# EAGLE design WiFi 5 Ray Detector v1 (EAGLE 7.7.0)
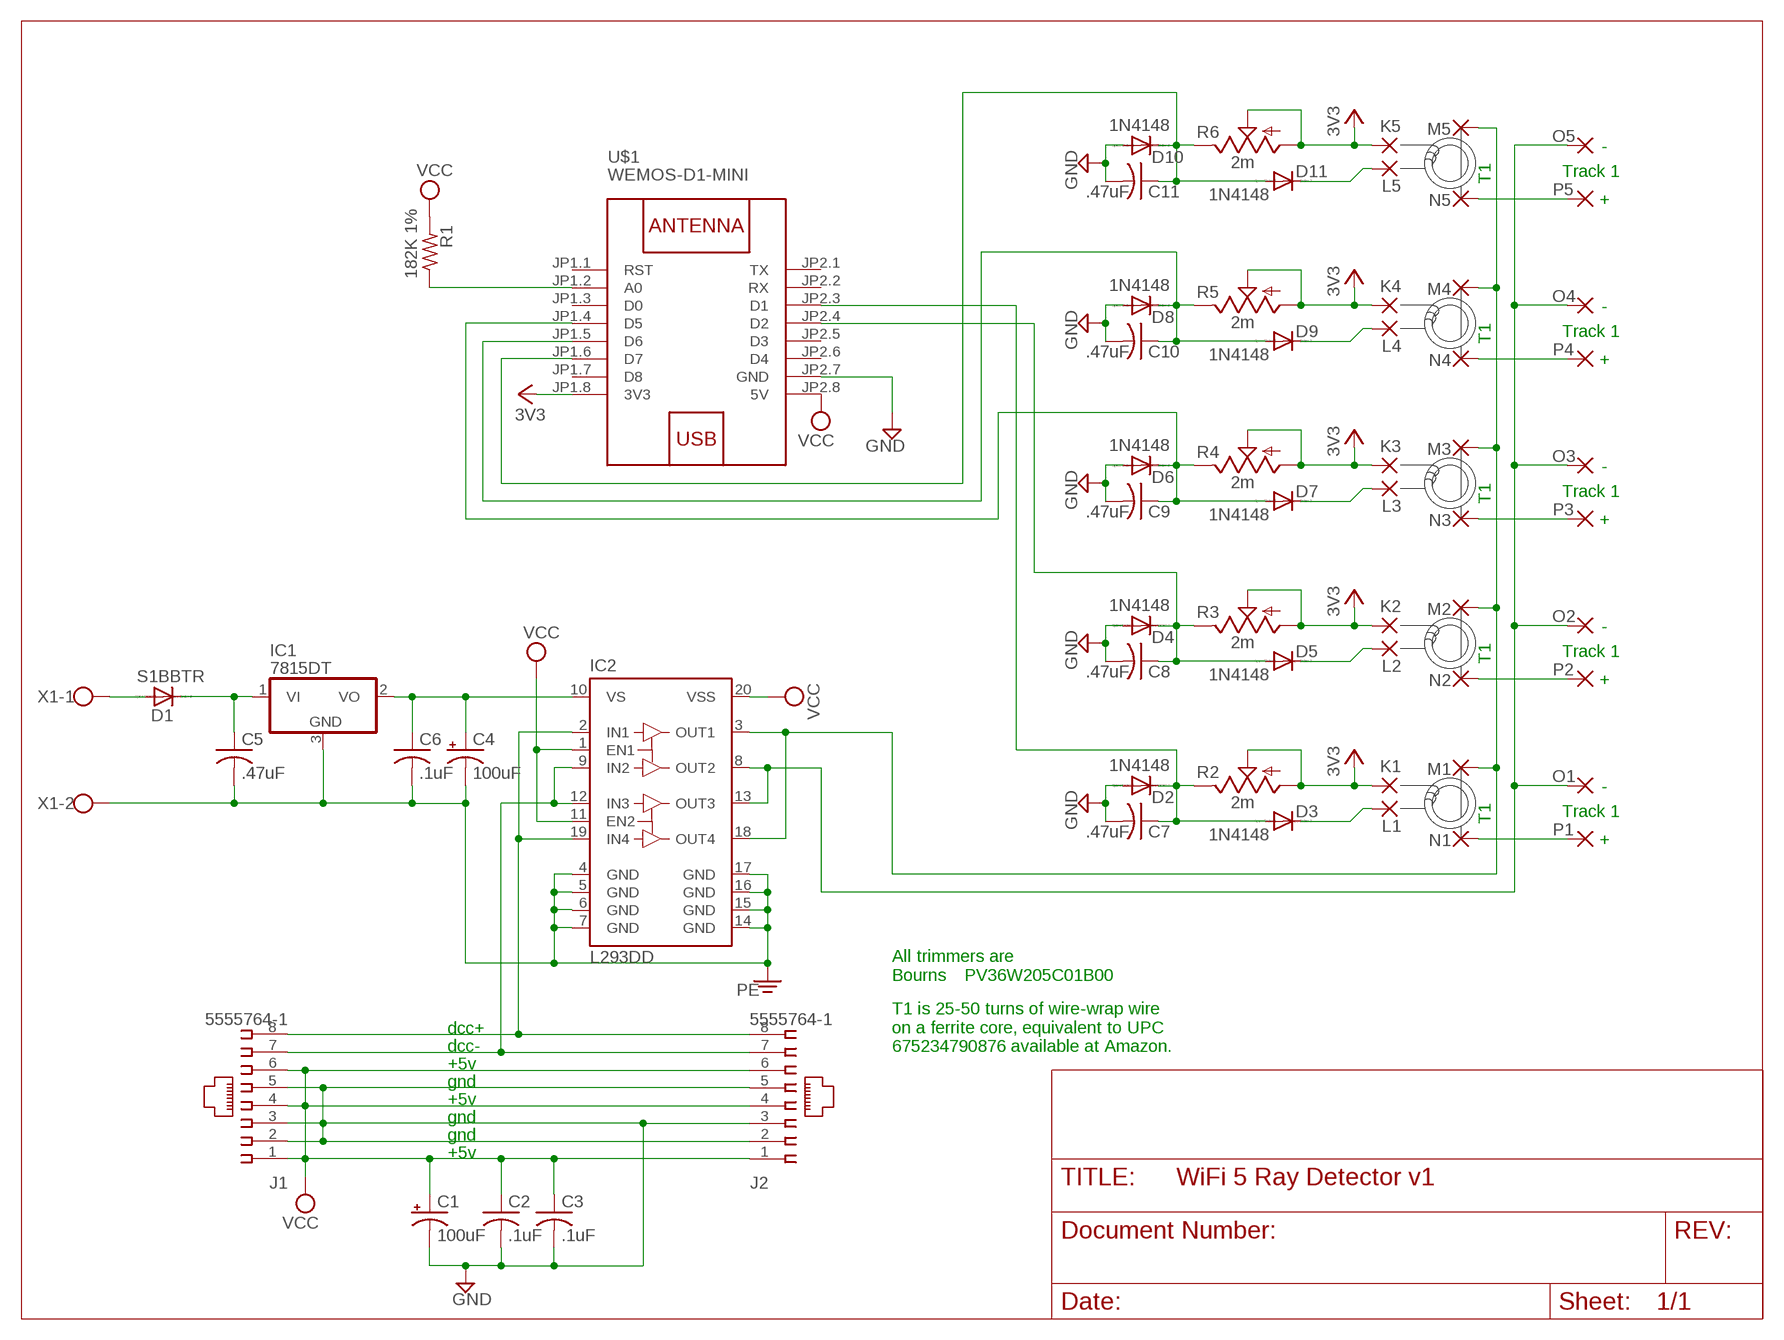
[diagram p0: schematic, sheet 1]

## Parts
C1  100uF  CPOL-USE3.5-8  [E3,5-8]
C2  .1uF  C-USC1206  [C1206]
C3  .1uF  C-USC1206  [C1206]
C4  100uF  CPOL-USE3.5-8  [E3,5-8]
C5  .47uF  C-USC1206  [C1206]
C6  .1uF  C-USC1206  [C1206]
C7  .47uF  C-USC1206  [C1206]
C8  .47uF  C-USC1206  [C1206]
C9  .47uF  C-USC1206  [C1206]
C10  .47uF  C-USC1206  [C1206]
C11  .47uF  C-USC1206  [C1206]
D1  S1BBTR  DIODE-DO-214AC  [DO-214AC]
D2  1N4148  DIODE-SOD123  [SOD123]
D3  1N4148  DIODE-SOD123  [SOD123]
D4  1N4148  DIODE-SOD123  [SOD123]
D5  1N4148  DIODE-SOD123  [SOD123]
D6  1N4148  DIODE-SOD123  [SOD123]
D7  1N4148  DIODE-SOD123  [SOD123]
D8  1N4148  DIODE-SOD123  [SOD123]
D9  1N4148  DIODE-SOD123  [SOD123]
D10  1N4148  DIODE-SOD123  [SOD123]
D11  1N4148  DIODE-SOD123  [SOD123]
IC1  7815DT  7818DT  [TO252]
IC2  L293DD  [SO20]
J1  5555764-1  520426-4  [520426-4]
J2  5555764-1  520426-4  [520426-4]
K1  2,15/1,0  [2,15/1,0]
K2  2,15/1,0  [2,15/1,0]
K3  2,15/1,0  [2,15/1,0]
K4  2,15/1,0  [2,15/1,0]
K5  2,15/1,0  [2,15/1,0]
L1  2,15/1,0  [2,15/1,0]
L2  2,15/1,0  [2,15/1,0]
L3  2,15/1,0  [2,15/1,0]
L4  2,15/1,0  [2,15/1,0]
L5  2,15/1,0  [2,15/1,0]
M1  NA  2,15/1,0  [2,15/1,0]
M2  NA  2,15/1,0  [2,15/1,0]
M3  NA  2,15/1,0  [2,15/1,0]
M4  NA  2,15/1,0  [2,15/1,0]
M5  NA  2,15/1,0  [2,15/1,0]
N1  NA  2,15/1,0  [2,15/1,0]
N2  NA  2,15/1,0  [2,15/1,0]
N3  NA  2,15/1,0  [2,15/1,0]
N4  NA  2,15/1,0  [2,15/1,0]
N5  NA  2,15/1,0  [2,15/1,0]
O1  NA  2,15/1,0  [2,15/1,0]
O2  NA  2,15/1,0  [2,15/1,0]
O3  NA  2,15/1,0  [2,15/1,0]
O4  NA  2,15/1,0  [2,15/1,0]
O5  NA  2,15/1,0  [2,15/1,0]
P1  NA  2,15/1,0  [2,15/1,0]
P2  NA  2,15/1,0  [2,15/1,0]
P3  NA  2,15/1,0  [2,15/1,0]
P4  NA  2,15/1,0  [2,15/1,0]
P5  NA  2,15/1,0  [2,15/1,0]
R1  182K 1%  R-US_M1206  [M1206]
R2  2m  TRIM_US-S63P  [S63P]
R3  2m  TRIM_US-S63P  [S63P]
R4  2m  TRIM_US-S63P  [S63P]
R5  2m  TRIM_US-S63P  [S63P]
R6  2m  TRIM_US-S63P  [S63P]
U$1  WEMOS-D1-MINI  [WEMOS-D1-MINI]
X1  W237-102  [W237-102]

## Nets
3V3: K1.1(P) K2.1(P) K3.1(P) K4.1(P) K5.1(P) R2.A R2.S R3.A R3.S R4.A R4.S R5.A R5.S R6.A R6.S U$1.JP1.8(3V3)
GND: C1.- C2.2 C3.2 C7.2 C8.2 C9.2 C10.2 C11.2 D2.A D4.A D6.A D8.A D10.A J1.2 J1.3 J1.5 J2.2 J2.3 J2.5 U$1.JP2.7(GND)
J1: N1.1(P) P1.1(P)
J2: N2.1(P) P2.1(P)
J3: N3.1(P) P3.1(P)
J4: N4.1(P) P4.1(P)
J5: N5.1(P) P5.1(P)
N$1: D5.C L2.1(P)
N$2: C9.1 D6.C D7.A R4.E U$1.JP1.4(D5)
N$3: C7.1 D2.C D3.A R2.E U$1.JP2.3(D1)
N$4: D1.A X1.1
N$5: C5.1 D1.C IC1.1(VI)
N$6: C8.1 D4.C D5.A R3.E U$1.JP2.4(D2)
N$7: IC2.9(IN2) IC2.12(IN3) J1.7 J2.7
N$8: D7.C L3.1(P)
N$9: C10.1 D8.C D9.A R5.E U$1.JP1.5(D6)
N$10: D9.C L4.1(P)
N$11: C11.1 D10.C D11.A R6.E U$1.JP1.6(D7)
N$12: R1.1 U$1.JP1.2(A0)
N$13: D11.C L5.1(P)
N$18: IC2.2(IN1) IC2.19(IN4) J1.8 J2.8
N$45: D3.C L1.1(P)
OUT+: IC2.3(OUT1) IC2.18(OUT4) M1.1(P) M2.1(P) M3.1(P) M4.1(P) M5.1(P)
OUT-: IC2.8(OUT2) IC2.13(OUT3) O1.1(P) O2.1(P) O3.1(P) O4.1(P) O5.1(P)
PE: C4.- C5.2 C6.2 IC1.3(GND) IC2.4(GND) IC2.5(GND) IC2.6(GND) IC2.7(GND) IC2.14(GND) IC2.15(GND) IC2.16(GND) IC2.17(GND) X1.2
VCC: C1.+ C2.1 C3.1 IC2.1(EN1) IC2.11(EN2) IC2.20(VSS) J1.1 J1.4 J1.6 J2.1 J2.4 J2.6 R1.2 U$1.JP2.8(5V)
VS: C4.+ C6.1 IC1.2(VO) IC2.10(VS)
Unconnected: U$1.JP1.1(RST) U$1.JP1.3(D0) U$1.JP1.7(D8) U$1.JP2.1(TX) U$1.JP2.2(RX) U$1.JP2.5(D3) U$1.JP2.6(D4)

## Notes on the sheet
- -
- T1
- Track 1
- +
- -
- T1
- Track 1
- +
- -
- T1
- Track 1
- +
- -
- T1
- Track 1
- +
- -
- T1
- Track 1
- +
- All trimmers are
  Bourns‎ PV36W205C01B00
- dcc+
- dcc-
- T1 is 25-50 turns of wire-wrap wire
  on a ferrite core, equivalent to UPC 
  675234790876 available at Amazon.
- +5v
- gnd
- +5v
- gnd
- gnd
- +5v

## Library data of the parts
C1 C4 = rcl:CPOL-US: POLARIZED CAPACITOR, American symbol
C2 C3 C5-C11 = rcl:C-US: CAPACITOR, American symbol
D1-D11 = diode:DIODE-: DIODE
IC1 = linear:78*: Positive VOLTAGE REGULATOR Source: http://cache.national.com/ds/LM/LM78L05.pdf http://www.fairchildsemi.com/ds/LM/LM7805.pdf
IC2 = st-microelectronics:L293DD: PUSH-PULL FOUR CHANNEL DRIVER WITH DIODES Source: http://www.st.com/stonline/books/pdf/docs/1330.pdf; OC_FARNELL: unknown
J1 J2 = con-amp:520426-4: AMP connector
K1-K5 L1-L5 M1-M5 N1-N5 O1-O5 P1-P5 = wirepad:2,15/1,0: THROUGH-HOLE PAD
R1 = rcl:R-US_: RESISTOR, American symbol
R2-R6 = pot:TRIM_US-: POTENTIOMETER
U$1 = diy-modules:WEMOS-D1-MINI: WEMOS D1 mini: Mini Wi-Fi Board based on ESP-8266 device More details can be found here: https://www.wemos.cc/product/d1-mini.html Click here to find device on ebay.com <http://www.ebay.com/sch/wemos+d1+mini+nodemcu>
X1 = con-wago-500:W237-102: WAGO SCREW CLAMP; MPN: 237-102; OC_FARNELL: unknown; OC_NEWARK: 70K9898

## Board
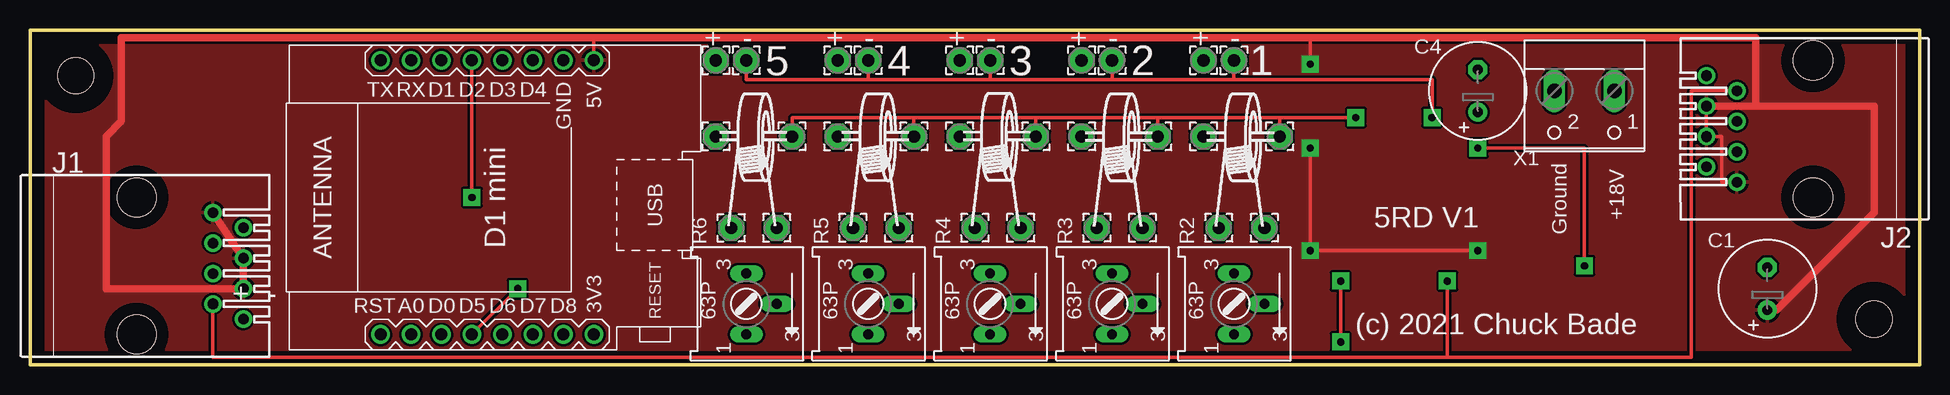
[diagram p1: board, top side]
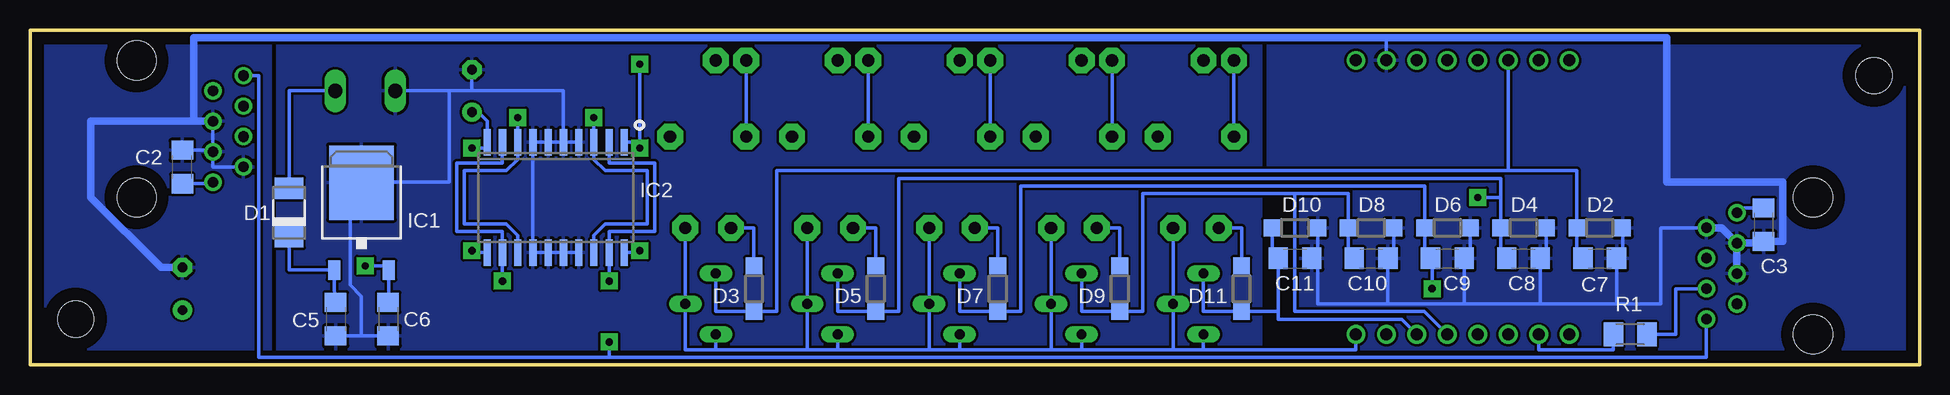
[diagram p2: board, bottom side, seen from below]

Size 157.48 x 27.94 mm. Coordinates in mm from the lower left corner, seen from the top.
Outline: 0,0 157.48,0 157.48,27.94 0,27.94 0,0
Copper layers (1*16): Top 0.035mm / dielectric 1.5mm / Bottom 0.035mm
Design rules "default *": minimum track width 10mil, minimum drill 10mil, track to track 8mil, track to pad 8mil, pad to pad 8mil, via to via 8mil, smd to smd 8mil, copper to edge 40mil, drill to drill 8mil, minimum pad ring 11mil, minimum via ring 16mil, stop-mask expansion 4mil, vias tented up to drill 0mil, thermal gap 10mil

### Footprints (pad centres in the part's own frame; a part is rotated, then mirrored left to right if it is on the bottom)
E3,5-8 = drill 0.813 pad 1.6: + -1.778,0 | drill 0.813 pad 1.6 octagon: - 1.778,0
C1206 = smd 1.6 x 1.8: 1 -1.4,0; 2 1.4,0
DO-214AC = smd 1.8 x 2.4: A 2.025,0; C -2.025,0
SOD123 = smd 1.4 x 1.4: A 1.9,0; C -1.9,0
TO252 = smd 1 x 1.6: 1 -2.28,-4.8; 2 2.28,-4.8 | smd 5.4 x 6.2: 3 0,2.5
SO20 = smd 0.6 x 2.2: 1 -5.715,-4.6; 2 -4.445,-4.6; 3 -3.175,-4.6; 4 -1.905,-4.6; 5 -0.635,-4.6; 6 0.635,-4.6; 7 1.905,-4.6; 8 3.175,-4.6; 9 4.445,-4.6; 10 5.715,-4.6; 11 5.715,4.6; 12 4.445,4.6; 13 3.175,4.6; 14 1.905,4.6; 15 0.635,4.6; 16 -0.635,4.6; 17 -1.905,4.6; 18 -3.175,4.6; 19 -4.445,4.6; 20 -5.715,4.6
520426-4 = drill 0.889: 1 -4.445,6.35; 2 -3.175,8.89; 3 -1.905,6.35; 4 -0.635,8.89; 5 0.635,6.35; 6 1.905,8.89; 7 3.175,6.35; 8 4.445,8.89 | hole 3.251: -5.715,0; 5.715,0
2,15/1,0 = drill 1.016 pad 2.159 octagon: 1 0,0
M1206 = smd 1.6 x 2: 1 -1.4,0; 2 1.4,0
S63P = drill 0.813 long: A 2.54,0; E -2.54,0; S 0,2.54
WEMOS-D1-MINI = drill 1: JP1.1 -11.43,9.525; JP1.2 -11.43,6.985; JP1.3 -11.43,4.445; JP1.4 -11.43,1.905; JP1.5 -11.43,-0.635; JP1.6 -11.43,-3.175; JP1.7 -11.43,-5.715; JP1.8 -11.43,-8.255; JP2.1 11.43,9.525; JP2.2 11.43,6.985; JP2.3 11.43,4.445; JP2.4 11.43,1.905; JP2.5 11.43,-0.635; JP2.6 11.43,-3.175; JP2.7 11.43,-5.715; JP2.8 11.43,-8.255
4-40SCREW = hole 2.997: 0,0
W237-102 = drill 1.194 long: 1 -2.5,-1.27; 2 2.5,-1.27

### Placement (x,y rotation side)
C1  144.78,6.35 90 top
C2  144.78,16.51 90 bottom
C3  13.02,11.68 270 bottom
C4  120.65,22.86 90 top
C5  132.02,3.81 270 bottom
C6  127.63,3.81 270 bottom
C7  26.67,8.89 0 bottom
C8  33.02,8.89 0 bottom
C9  39.37,8.89 0 bottom
C10  45.72,8.89 0 bottom
C11  52.07,8.89 0 bottom
D1  135.89,12.7 90 bottom
D2  26.67,11.43 0 bottom
D3  97.16,6.35 270 bottom
D4  33.02,11.43 0 bottom
D5  86.99,6.35 270 bottom
D6  39.37,11.43 0 bottom
D7  76.83,6.35 270 bottom
D8  45.72,11.43 0 bottom
D9  66.67,6.35 270 bottom
D10  52.07,11.43 0 bottom
D11  56.52,6.35 270 bottom
IC1  129.86,12.7 0 bottom
IC2  113.66,13.97 180 bottom
J1  8.89,8.26 270 top
J2  148.59,19.68 90 top
K1  102.87,11.43 0 top
K2  92.71,11.43 0 top
K3  82.55,11.43 0 top
K4  72.39,11.43 0 top
K5  62.23,11.43 0 top
L1  99.06,11.43 0 top
L2  88.9,11.43 0 top
L3  78.74,11.43 0 top
L4  68.58,11.43 0 top
L5  58.43,11.42 0 top
M1  104.14,19.05 0 top
M2  93.98,19.05 0 top
M3  83.82,19.05 0 top
M4  73.66,19.05 0 top
M5  63.5,19.05 0 top
N1  97.79,19.05 0 top
N2  87.63,19.05 0 top
N3  77.47,19.05 0 top
N4  67.31,19.05 0 top
N5  57.15,19.05 0 top
O1  100.33,25.4 0 top
O2  90.17,25.4 0 top
O3  80.01,25.4 0 top
O4  69.85,25.4 0 top
O5  59.69,25.4 0 top
P1  97.79,25.4 0 top
P2  87.63,25.4 0 top
P3  77.47,25.4 0 top
P4  67.31,25.4 0 top
P5  57.15,25.4 0 top
R1  24.13,2.54 0 bottom
R2  100.33,5.08 270 top
R3  90.17,5.08 270 top
R4  80.01,5.08 270 top
R5  69.85,5.08 270 top
R6  59.69,5.08 270 top
U$1  38.73,13.97 90 top
U$3  [4-40SCREW]  3.81,24.13 0 top
U$4  [4-40SCREW]  153.67,3.81 0 top
X1  129.54,21.59 180 top

### Tracks (layer width: path | path; a pad name or v marks a point on that pad's centre or on a via)
3V3
  Bottom 0.305: U$1.JP1.8 46.99,1.27 59.69,1.27 | R6.A 59.69,1.27 | R5.A 69.85,1.27 | 69.85,1.27 62.23,1.27 | 62.23,1.27 59.69,1.27 | R4.A 80.01,1.27 | 80.01,1.27 72.39,1.27 | 72.39,1.27 69.85,1.27 | 62.23,1.27 R6.S K5.1 | 72.39,1.27 R5.S K4.1 | K3.1 R4.S 82.55,1.27 | 82.55,1.27 80.01,1.27 | R3.A 90.17,1.27 | 90.17,1.27 82.55,1.27 | 92.71,1.27 R3.S K2.1 | 92.71,1.27 90.17,1.27 | R2.A 100.33,1.27 | 100.33,1.27 92.71,1.27 | 100.33,1.27 102.87,1.27 R2.S K1.1
GND
  Bottom 0.305: C2.2 142.37,17.91 J2.3 | J2.2 142.24,16.51 J2.3 | U$1.JP2.7 44.45,27.31 | J2.5 J2.3 | D2.A 24.77,8.89 C7.2 25.27,5.08 | D4.A 31.12,8.89 C8.2 31.62,5.08 | D6.A 37.47,8.89 C9.2 37.97,5.08 | D8.A 43.82,8.89 C10.2 44.32,5.08 | D10.A 50.17,8.89 | 50.17,8.89 C11.2 | 50.17,8.89 50.17,5.08 44.32,5.08 | 44.32,5.08 37.97,5.08 | 37.97,5.08 31.62,5.08 | 31.62,5.08 25.27,5.08 | 25.27,5.08 21.59,5.08 21.59,11.43 J1.2
  Bottom 0.61: J2.5 143.83,20.32 | 143.83,20.32 143.83,27.31 44.45,27.31 21.08,27.31 21.08,15.24 11.43,15.24 11.43,10.28 C3.2 13.02,10.16 J1.3 | 143.83,20.32 152.4,20.32 152.4,13.97 146.56,8.13 C1.- | J1.5 J1.3 | J1.3 16.51,11.43 J1.2
  pour Bottom: -0.95,28.57 54.29,28.57 54.29,-0.95 -0.95,-0.95
  pour Bottom: 158.43,28.57 137.48,28.57 137.48,-0.95 158.43,-0.95
J1
  Bottom 0.305: P1.1 N1.1
J2
  Bottom 0.305: P2.1 N2.1
J3
  Bottom 0.305: P3.1 N3.1
J4
  Bottom 0.305: P4.1 N4.1
J5
  Bottom 0.305: P5.1 N5.1
N$1
  Bottom 0.305: L2.1 86.99,11.43 D5.C
N$2  (via drill 0.6)
  Top 0.305: v40.64,6.35 U$1.JP1.4
  Bottom 0.305: v40.64,6.35 40.64,8.89 C9.1 41.27,8.89 D6.C 41.27,14.92 74.93,14.92 74.93,4.45 D7.A 80.01,4.45 R4.E
N$3
  Bottom 0.305: 34.29,16.19 28.57,16.19 D2.C 28.57,8.89 C7.1 | 34.29,16.19 95.25,16.19 95.25,4.45 D3.A 100.33,4.45 R2.E | U$1.JP2.3 34.29,16.19
N$4
  Bottom 0.305: D1.A 135.89,22.86 X1.1
N$5
  Bottom 0.305: 132.21,7.9 IC1.1 | IC1.1 132.14,6.28 C5.1 132.02,5.08 | D1.C 135.89,7.9 IC1.1
N$6  (via drill 0.6)
  Top 0.305: U$1.JP2.4 v36.83,13.97
  Bottom 0.305: 34.92,13.97 D4.C 34.92,8.89 C8.1 | 34.92,13.97 34.92,15.56 85.09,15.56 85.09,4.45 D5.A 90.17,4.45 R3.E | v36.83,13.97 34.92,13.97
N$7  (via drill 0.6)
  Top 0.305: J1.7 15.24,0.64 118.11,0.64 | 118.11,0.64 138.43,0.64 138.43,22.86 J2.7 | v118.11,6.99 118.11,0.64
  Bottom 0.305: IC2.9 118.11,16.83 121.92,16.83 121.92,11.11 118.11,11.11 IC2.12 v118.11,6.99
N$8
  Bottom 0.305: L3.1 76.83,11.43 D7.C
N$9
  Bottom 0.305: U$1.JP1.5 41.27,4.45 52.07,4.45 52.07,14.29 | 52.07,14.29 47.62,14.29 D8.C 47.62,8.89 C10.1 | 52.07,14.29 64.77,14.29 64.77,4.45 D9.A 69.85,4.45 R5.E
N$10
  Bottom 0.305: L4.1 66.68,11.43 D9.C
N$11
  Bottom 0.305: D10.C 53.97,8.89 C11.1 53.47,4.45 | 53.47,4.45 53.47,3.81 43.18,3.81 U$1.JP1.6 | 53.47,4.45 D11.A 59.69,4.45 R6.E
N$12
  Bottom 0.305: R1.1 25.53,1.27 31.75,1.27 U$1.JP1.2
N$13
  Bottom 0.305: L5.1 56.52,11.43 D11.C
N$18  (via drill 0.6)
  Top 0.305: v109.22,6.99 v109.22,1.91
  Bottom 0.305: IC2.2 109.22,16.83 105.41,16.83 105.41,11.11 109.22,11.11 IC2.19 v109.22,6.99 | J1.8 17.78,0.64 109.22,0.64 | 109.22,0.64 138.43,0.64 138.43,24.13 J2.8 | v109.22,1.91 109.22,0.64
N$45
  Bottom 0.305: L1.1 97.15,11.43 D3.C
OUT+  (via drill 0.6)
  Top 0.305: M5.1 63.5,20.64 73.66,20.64 | 73.66,20.64 83.82,20.64 | 83.82,20.64 93.98,20.64 | 93.98,20.64 104.14,20.64 | M4.1 73.66,20.64 | M3.1 83.82,20.64 | M2.1 93.98,20.64 | M1.1 104.14,20.64 | v110.49,20.64 104.14,20.64
  Bottom 0.305: IC2.18 110.49,10.8 109.54,11.75 106.04,11.75 106.04,16.19 109.54,16.19 110.49,17.15 IC2.3 v110.49,20.64
OUT-  (via drill 0.6)
  Top 0.305: v116.84,20.64 116.84,23.81 100.33,23.81 | 100.33,23.81 90.17,23.81 | 90.17,23.81 80.01,23.81 | 80.01,23.81 69.85,23.81 | 69.85,23.81 59.69,23.81 O5.1 | O4.1 69.85,23.81 | O3.1 80.01,23.81 | O2.1 90.17,23.81 | O1.1 100.33,23.81
  Bottom 0.305: IC2.13 116.84,10.8 117.79,11.75 121.28,11.75 121.28,16.19 117.79,16.19 116.84,17.15 IC2.8 v116.84,20.64
PE
  Bottom 0.305: IC2.5 IC2.6 IC2.7 IC2.14 IC2.15 IC2.16 IC2.17 | IC2.4 IC2.5 | C6.2 129.86,2.41 | 129.86,2.41 C5.2 | 130.81,15.2 130.81,15.24 132.08,15.24 | 122.55,22.86 122.55,15.24 129.86,15.24 IC1.3 130.81,15.2 | 130.81,15.2 130.81,6.67 129.86,5.72 129.86,2.41 | 122.55,22.86 X1.2 | IC2.5 113.03,22.86 120.65,22.86 | 120.65,22.86 C4.- | 120.65,22.86 122.55,22.86
  pour Bottom: 54.93,28.57 136.84,28.57 136.84,-0.95 54.93,-0.95
VCC  (via drill 0.6)
  Top 0.305: J2.6 J2.4 140.97,19.05 140.97,15.24 J2.1 | U$1.JP2.8 46.99,27.31 | v106.68,18.1 v106.68,9.53 v120.65,9.53 | v106.68,25.08 106.68,27.31
  Top 0.61: J2.6 143.83,21.59 | 143.83,21.59 143.83,27.31 106.68,27.31 46.99,27.31 7.62,27.31 7.62,20.32 6.35,19.05 6.35,6.35 J1.6 J1.4 J1.1 | C1.+ 145.54,4.57 153.67,12.7 153.67,21.59 143.83,21.59
  Bottom 0.305: 119.38,9.84 IC2.11 120.49,9.37 v120.65,9.53 | 107.95,18.73 IC2.1 106.68,18.57 v106.68,18.1 v106.68,25.08 | C2.1 142.37,15.11 J2.1 | IC2.20 106.83,9.37 v106.68,9.53 | J1.1 14.86,13.08 C3.1 | R1.2 20.32,2.54 20.32,6.35 J1.6
  pour Top: -2.22,29.53 159.7,29.21 159.7,-1.59 -2.22,-1.27
VS  (via drill 0.6)
  Top 0.305: v120.65,18.1 129.54,18.1 v129.54,8.26
  Bottom 0.305: IC1.2 127.58,7.62 | C6.1 127.58,6.22 IC1.2 | v120.65,18.1 119.38,18.1 IC2.10 119.38,20.32 120.14,21.08 C4.+ | 128.27,5.72 C6.1 | 127.63,5.08 C6.1 | v129.54,8.26 127.58,8.26 IC1.2

### Text on the board
bOrigins: C2,3,6 .1uf / C5,7-11 .47uf / D1 S1BBTR / D2-11 1N4148 / IC1 7815 / IC2 L293DD / R1 182K
tNames: + | - | + | - | + | - | + | - | + | - | 5 | 4 | 3 | 2 | 1 | Ground | +18V | 5RD V1 | + - | (c) 2021 Chuck Bade